# Altium schematic sheet Sheet1.SchDoc
size B
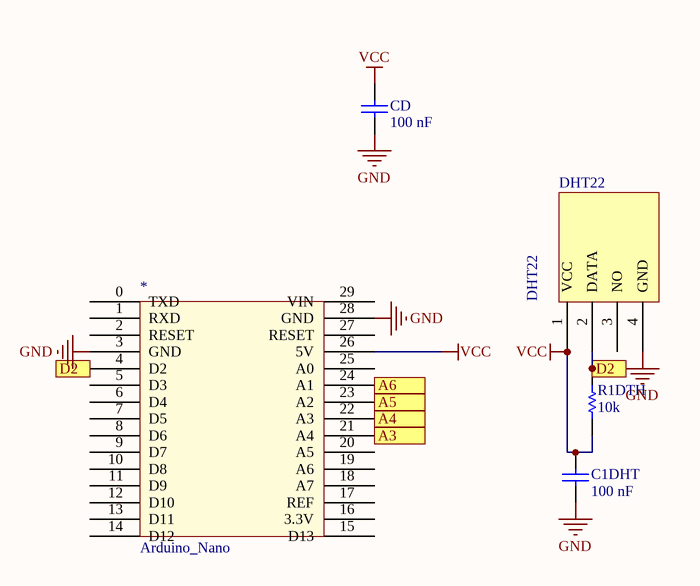
[diagram p0: Sheet1.SchDoc]

## Parts
*  Arduino_Nano  [Arduino Nano SMD]
C1DHT  100 nF  [CAP 0805]
CD  100 nF  [CAP 0805]
DHT22  DHT22  [DHT22 - 90deg SMD]
R1DTH  value 10k  [RES 0805]  (hidden comment: RES 0805)

## Ports
A3, A4, A5, A6, D2

## Nets
GND: *.3(GND) *.28(GND) C1DHT.1 CD.1 DHT22.4(GND)
VCC: *.26(5V) C1DHT.2 CD.2 DHT22.1(VCC) R1DTH.1
A3: *.21(A4) ; port A3
A4: *.22(A3) ; port A4
A5: *.23(A2) ; port A5
A6: *.24(A1) ; port A6
D2: *.4(D2) DHT22.2(DATA) R1DTH.2 ; port D2

Not connected (* = marked no-connect by the designer): * 0(TXD) 1(RXD) 2(RESET) 5(D3) 6(D4) 7(D5) 8(D6) 9(D7) 10(D8) 11(D9) 12(D10) 13(D11) 14(D12) 15(D13) 16(3.3V) 17(REF) 18(A7) 19(A6) 20(A5) 25(A0) 27(RESET) 29(VIN); DHT22 3(NO)

## Library data of the parts
C1DHT CD = CAP 0805: Value: 5 pF
R1DTH = RES 0805: SMD Resistor 0805